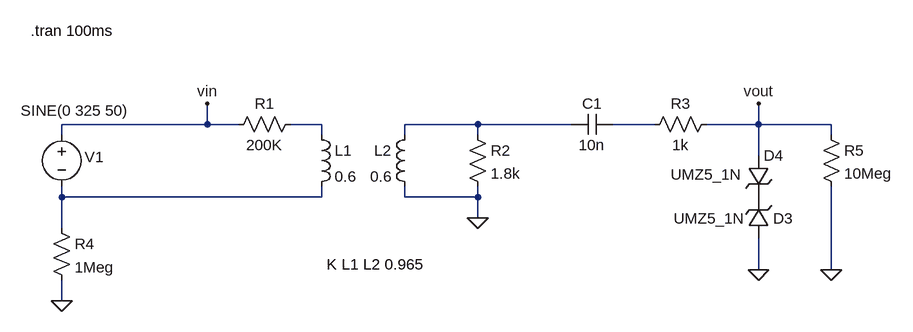
[diagram p0: schematic voltage_sim.asc]
voltage_sim.asc, the LTspice schematic file:
Version 4.1
SHEET 1 996 880
WIRE -64 80 -64 48
WIRE -64 80 -288 80
WIRE -16 80 -64 80
WIRE 112 80 64 80
WIRE 352 80 240 80
WIRE 496 80 352 80
WIRE 624 80 560 80
WIRE 784 80 784 48
WIRE 784 80 704 80
WIRE 896 80 784 80
WIRE -288 96 -288 80
WIRE 112 96 112 80
WIRE 240 96 240 80
WIRE 352 96 352 80
WIRE 896 96 896 80
WIRE 784 128 784 80
WIRE -288 192 -288 176
WIRE 112 192 112 176
WIRE 112 192 -288 192
WIRE 240 192 240 176
WIRE 352 192 352 176
WIRE 352 192 240 192
WIRE 352 224 352 192
WIRE -288 240 -288 192
WIRE 784 304 784 256
WIRE 896 304 896 176
WIRE -288 352 -288 320
FLAG 352 224 0
FLAG -288 352 0
FLAG 896 304 0
FLAG 784 304 0
FLAG -64 48 vin
FLAG 784 48 vout
SYMBOL voltage -288 80 R0
WINDOW 0 35 50 Left 2
WINDOW 3 -63 -21 Left 2
WINDOW 123 0 0 Left 0
WINDOW 39 0 0 Left 0
SYMATTR InstName V1
SYMATTR Value SINE(0 325 50)
SYMBOL res 336 80 R0
SYMATTR InstName R2
SYMATTR Value 1.8k
SYMBOL cap 560 64 R90
WINDOW 0 0 32 VBottom 2
WINDOW 3 32 32 VTop 2
SYMATTR InstName C1
SYMATTR Value 10n
SYMBOL res 80 64 R90
WINDOW 0 0 56 VBottom 2
WINDOW 3 32 56 VTop 2
SYMATTR InstName R1
SYMATTR Value 200K
SYMBOL res -304 224 R0
SYMATTR InstName R4
SYMATTR Value 1Meg
SYMBOL ind 96 80 R0
SYMATTR InstName L1
SYMATTR Value 0.6
SYMATTR Type ind
SYMATTR SpiceLine Rser=120
SYMBOL ind 256 80 M0
SYMATTR InstName L2
SYMATTR Value 0.6
SYMATTR Type ind
SYMATTR SpiceLine Rser=120
SYMBOL res 880 80 R0
SYMATTR InstName R5
SYMATTR Value 10Meg
SYMBOL zener 800 256 R180
WINDOW 0 -37 31 Left 2
WINDOW 3 36 31 Left 2
SYMATTR InstName D3
SYMATTR Value UMZ5_1N
SYMBOL zener 768 128 R0
WINDOW 3 -119 29 Left 2
SYMATTR InstName D4
SYMATTR Value UMZ5_1N
SYMBOL res 720 64 R90
WINDOW 0 0 56 VBottom 2
WINDOW 3 32 56 VTop 2
SYMATTR InstName R3
SYMATTR Value 1k
TEXT 120 296 Left 2 !K L1 L2 0.965
TEXT -336 -64 Left 2 !.tran 100ms

The netlist it stands for:
* voltage_sim.asc
V1 vin N004 SINE(0 325 50)
R2 N002 0 1.8k
C1 N003 N002 10n
R1 N001 vin 200K
R4 N004 0 1Meg
L1 N001 N004 0.6 Rser=120
L2 N002 0 0.6 Rser=120
R5 vout 0 10Meg
D3 0 P001 UMZ5_1N
D4 vout P001 UMZ5_1N
R3 vout N003 1k
.model D D
.lib standard.dio
K L1 L2 0.965
.tran 100ms
.backanno
.end

* Results of the author's LTspice run, read from the files saved beside the schematic
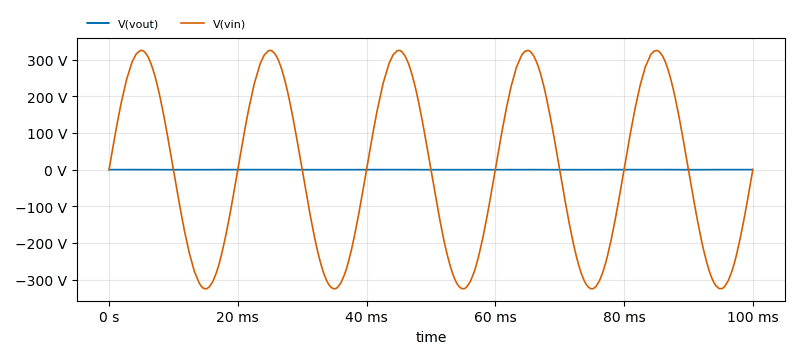
[diagram p1: Transient Analysis of voltage_sim.asc, plotted from the saved traces]
* Transient Analysis, 1 run:
*   V(vout): min -274.8 mV, max 275.2 mV, average -870.4 µV, rms 193.5 mV, last 274.5 mV
*   V(vin): min -324.8 V, max 325 V, average -91.78 mV, rms 229.8 V, last 0 V